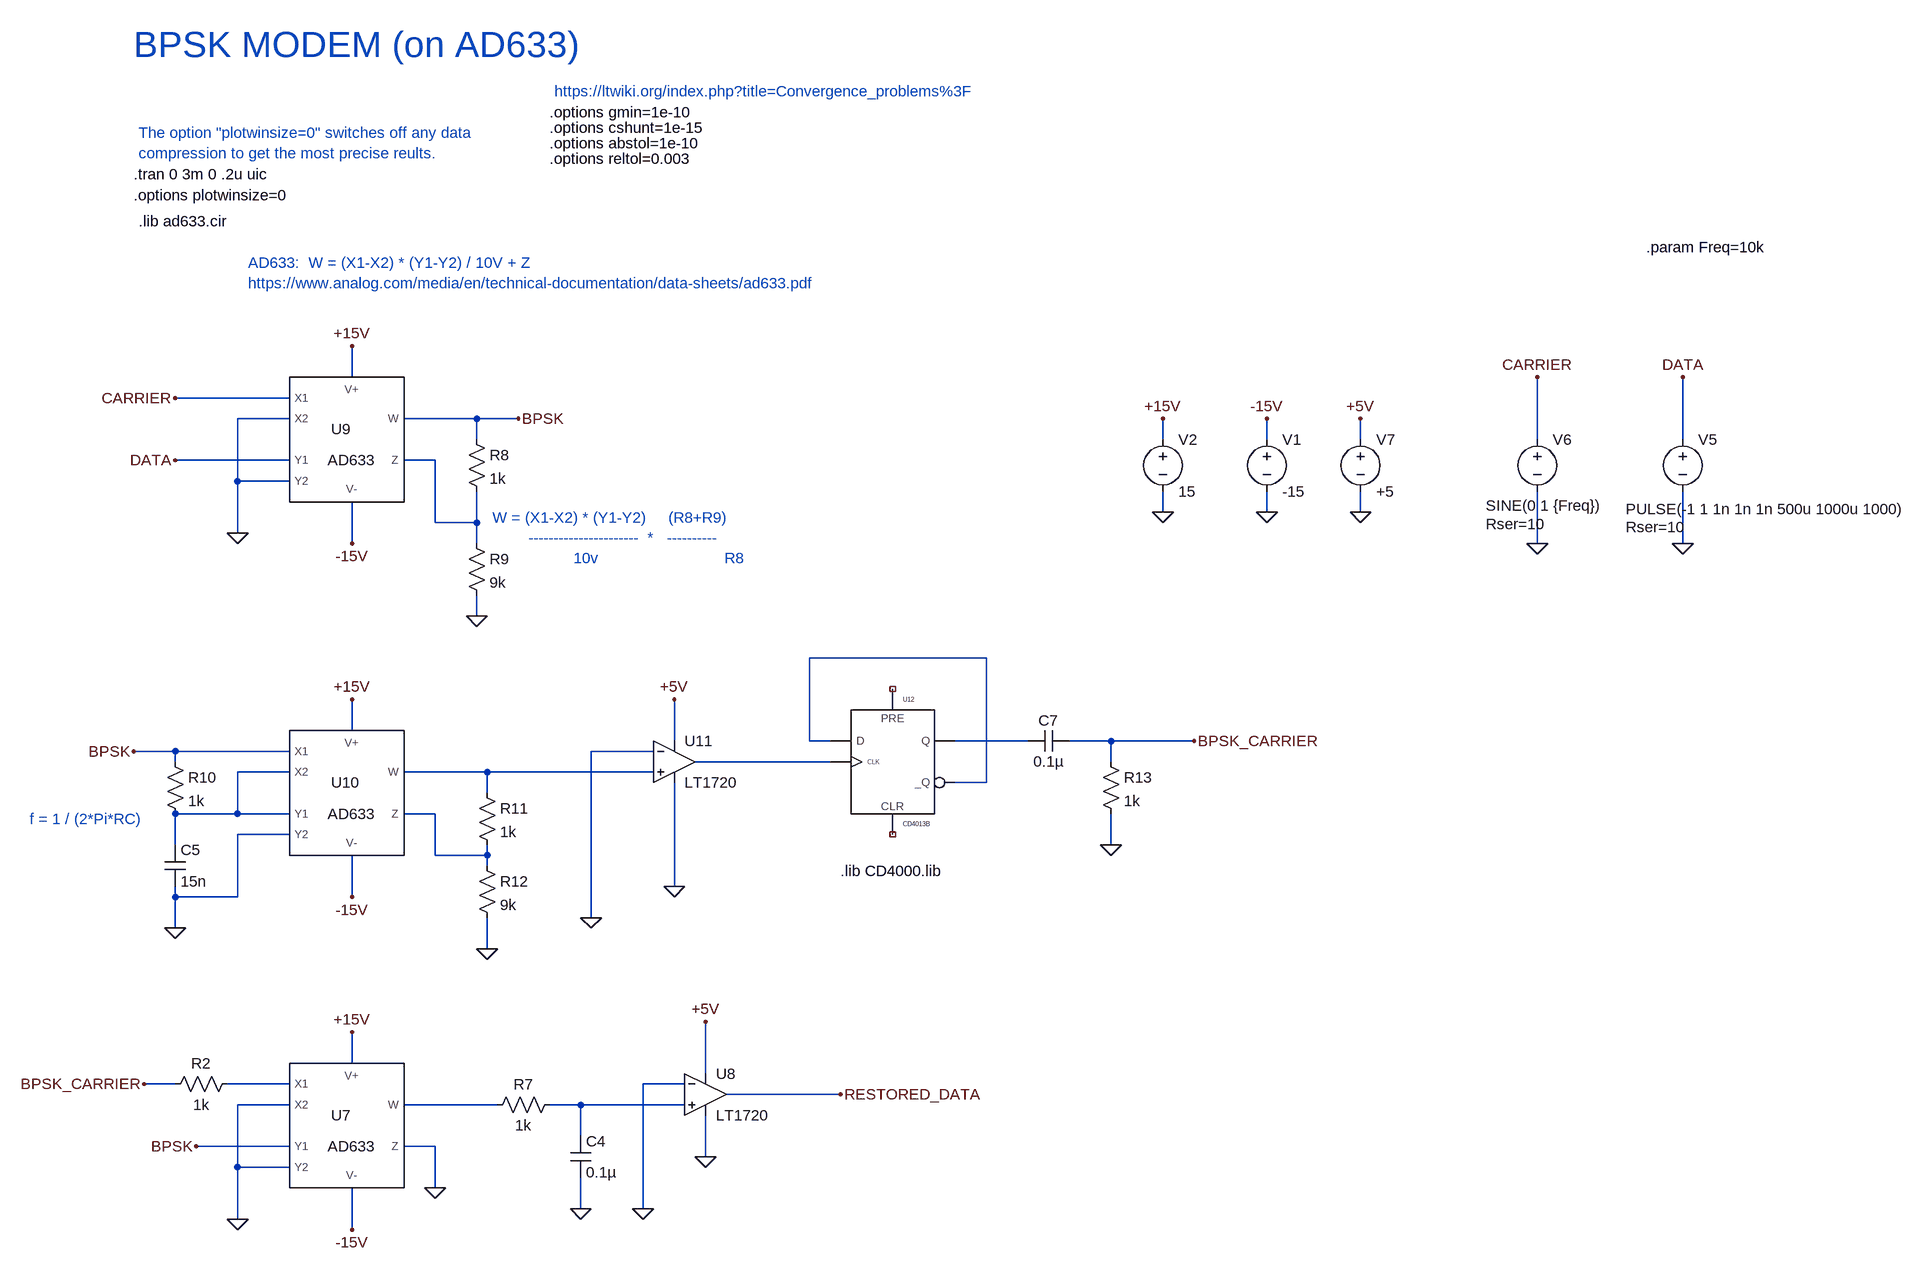
[diagram p0: schematic BPSK-modem-AD633.asc]
BPSK-modem-AD633.asc, the LTspice schematic file:
Version 4
SHEET 1 2516 2052
WIRE -800 416 -800 368
WIRE -896 448 -1072 448
WIRE -896 480 -976 480
WIRE -608 480 -720 480
WIRE -544 480 -608 480
WIRE -608 512 -608 480
WIRE 448 512 448 480
WIRE 608 512 608 480
WIRE 752 512 752 480
WIRE 1024 512 1024 416
WIRE 1248 512 1248 416
WIRE -896 544 -1072 544
WIRE -672 544 -720 544
WIRE -976 576 -976 480
WIRE -896 576 -976 576
WIRE 448 624 448 592
WIRE 608 624 608 592
WIRE 752 624 752 592
WIRE -672 640 -672 544
WIRE -608 640 -608 592
WIRE -608 640 -672 640
WIRE -976 656 -976 576
WIRE -800 672 -800 608
WIRE -608 672 -608 640
WIRE 1024 672 1024 592
WIRE 1248 672 1248 592
WIRE -608 784 -608 752
WIRE 176 848 -96 848
WIRE -800 960 -800 912
WIRE -304 976 -304 912
WIRE -96 976 -96 848
WIRE -64 976 -96 976
WIRE 240 976 128 976
WIRE 368 976 304 976
WIRE 496 976 368 976
WIRE -1072 992 -1136 992
WIRE -896 992 -1072 992
WIRE -336 992 -432 992
WIRE -1072 1008 -1072 992
WIRE -64 1008 -272 1008
WIRE 368 1008 368 976
WIRE -896 1024 -976 1024
WIRE -592 1024 -720 1024
WIRE -336 1024 -592 1024
WIRE 176 1040 176 848
WIRE 176 1040 128 1040
WIRE -592 1056 -592 1024
WIRE -976 1088 -976 1024
WIRE -976 1088 -1072 1088
WIRE -896 1088 -976 1088
WIRE -672 1088 -720 1088
WIRE -896 1120 -976 1120
WIRE -1072 1136 -1072 1088
WIRE 368 1136 368 1088
WIRE -672 1152 -672 1088
WIRE -592 1152 -592 1136
WIRE -592 1152 -672 1152
WIRE -592 1168 -592 1152
WIRE -304 1200 -304 1040
WIRE -1072 1216 -1072 1200
WIRE -976 1216 -976 1120
WIRE -976 1216 -1072 1216
WIRE -800 1216 -800 1152
WIRE -432 1248 -432 992
WIRE -1072 1264 -1072 1216
WIRE -592 1296 -592 1248
WIRE -800 1472 -800 1424
WIRE -256 1488 -256 1408
WIRE -1072 1504 -1120 1504
WIRE -896 1504 -992 1504
WIRE -288 1504 -352 1504
WIRE -48 1520 -224 1520
WIRE -896 1536 -976 1536
WIRE -576 1536 -720 1536
WIRE -448 1536 -496 1536
WIRE -288 1536 -448 1536
WIRE -448 1584 -448 1536
WIRE -896 1600 -1040 1600
WIRE -672 1600 -720 1600
WIRE -256 1616 -256 1552
WIRE -976 1632 -976 1536
WIRE -896 1632 -976 1632
WIRE -672 1664 -672 1600
WIRE -448 1696 -448 1648
WIRE -352 1696 -352 1504
WIRE -976 1712 -976 1632
WIRE -800 1728 -800 1664
FLAG 608 480 -15V
FLAG 448 480 +15V
FLAG 448 624 0
FLAG 608 624 0
FLAG 1248 672 0
FLAG 1024 672 0
FLAG 1024 416 CARRIER
FLAG 1248 416 DATA
FLAG 752 624 0
FLAG 752 480 +5V
FLAG -672 1664 0
FLAG -976 1712 0
FLAG -1120 1504 BPSK_CARRIER
FLAG -1040 1600 BPSK
FLAG -800 1728 -15V
FLAG -800 1424 +15V
FLAG -448 1696 0
FLAG -352 1696 0
FLAG -256 1616 0
FLAG -256 1408 +5V
FLAG -48 1520 RESTORED_DATA
FLAG -800 368 +15V
FLAG -800 672 -15V
FLAG -976 656 0
FLAG -1072 544 DATA
FLAG -1072 448 CARRIER
FLAG -608 784 0
FLAG -544 480 BPSK
FLAG -800 912 +15V
FLAG -800 1216 -15V
FLAG -1136 992 BPSK
FLAG -1072 1264 0
FLAG -592 1296 0
FLAG -432 1248 0
FLAG -304 1200 0
FLAG -304 912 +5V
FLAG 368 1136 0
FLAG 496 976 BPSK_CARRIER
SYMBOL voltage 608 496 R0
WINDOW 123 0 0 Left 0
WINDOW 39 0 0 Left 0
SYMATTR InstName V1
SYMATTR Value -15
SYMBOL voltage 448 496 R0
WINDOW 123 0 0 Left 0
WINDOW 39 0 0 Left 0
SYMATTR InstName V2
SYMATTR Value 15
SYMBOL voltage 1248 496 R0
WINDOW 3 -88 123 Left 2
WINDOW 123 0 0 Left 0
WINDOW 39 -88 151 Left 2
SYMATTR Value PULSE(-1 1 1n 1n 1n 500u 1000u 1000)
SYMATTR SpiceLine Rser=10
SYMATTR InstName V5
SYMBOL voltage 1024 496 R0
WINDOW 3 -79 118 Left 2
WINDOW 123 0 0 Left 0
WINDOW 39 -79 146 Left 2
SYMATTR Value SINE(0 1 {Freq})
SYMATTR SpiceLine Rser=10
SYMATTR InstName V6
SYMBOL voltage 752 496 R0
WINDOW 123 0 0 Left 0
WINDOW 39 0 0 Left 0
SYMATTR InstName V7
SYMATTR Value +5
SYMBOL ad633 -800 1568 R0
SYMATTR InstName U7
SYMBOL res -976 1488 R90
WINDOW 0 0 56 VBottom 2
WINDOW 3 32 56 VTop 2
SYMATTR InstName R2
SYMATTR Value 1k
SYMBOL res -480 1520 R90
WINDOW 0 0 56 VBottom 2
WINDOW 3 32 56 VTop 2
SYMATTR InstName R7
SYMATTR Value 1k
SYMBOL cap -464 1584 R0
SYMATTR InstName C4
SYMATTR Value 0.1µ
SYMBOL Comparators\\LT1720 -256 1456 R0
SYMATTR InstName U8
SYMBOL ad633 -800 512 R0
SYMATTR InstName U9
SYMBOL res -624 496 R0
SYMATTR InstName R8
SYMATTR Value 1k
SYMBOL res -624 656 R0
SYMATTR InstName R9
SYMATTR Value 9k
SYMBOL ad633 -800 1056 R0
SYMATTR InstName U10
SYMBOL res -1088 992 R0
SYMATTR InstName R10
SYMATTR Value 1k
SYMBOL cap -1088 1136 R0
SYMATTR InstName C5
SYMATTR Value 15n
SYMBOL res -608 1040 R0
SYMATTR InstName R11
SYMATTR Value 1k
SYMBOL res -608 1152 R0
SYMATTR InstName R12
SYMATTR Value 9k
SYMBOL Comparators\\LT1720 -304 944 R0
SYMATTR InstName U11
SYMBOL CD4000\\CD4013B 32 896 R0
SYMATTR InstName U12
SYMBOL cap 304 960 R90
WINDOW 0 0 32 VBottom 2
WINDOW 3 32 32 VTop 2
SYMATTR InstName C7
SYMATTR Value 0.1µ
SYMBOL res 352 992 R0
SYMATTR InstName R13
SYMATTR Value 1k
TEXT -1128 40 Left 2 ;The option "plotwinsize=0" switches off any data \ncompression to get the most precise reults.
TEXT -1136 136 Left 2 !.options plotwinsize=0
TEXT -960 240 Left 2 ;AD633:  W = (X1-X2) * (Y1-Y2) / 10V + Z\nhttps://www.analog.com/media/en/technical-documentation/data-sheets/ad633.pdf
TEXT -1136 104 Left 2 !.tran 0 3m 0 .2u uic
TEXT -1128 176 Left 2 !.lib ad633.cir
TEXT -1136 -96 Left 5 ;BPSK MODEM (on AD633)
TEXT -496 56 Left 2 !.options abstol=1e-10
TEXT -496 8 Left 2 !.options gmin=1e-10
TEXT -496 80 Left 2 !.options reltol=0.003
TEXT -496 32 Left 2 !.options cshunt=1e-15
TEXT -488 -24 Left 2 ;https://ltwiki.org/index.php?title=Convergence_problems%3F
TEXT -584 632 Left 2 ;W = (X1-X2) * (Y1-Y2)     (R8+R9)\n        ----------------------  *   ----------\n                  10v                            R8
TEXT -48 1176 Left 2 !.lib CD4000.lib
TEXT -1296 1096 Left 2 ;f = 1 / (2*Pi*RC)
TEXT 1192 216 Left 2 !.param Freq=10k

The netlist it stands for:
* BPSK-modem-AD633.asc
V1 -15V 0 -15
V2 +15V 0 15
V5 DATA 0 PULSE(-1 1 1n 1n 1n 500u 1000u 1000) Rser=10
V6 CARRIER 0 SINE(0 1 {Freq}) Rser=10
V7 +5V 0 +5
XU7 N008 0 BPSK 0 -15V 0 N009 +15V AD633  ; pins X1 X2 Y1 Y2 V- Z W V+
R2 N008 BPSK_CARRIER 1k
R7 N010 N009 1k
C4 N010 0 0.1µ
XU8 N010 0 +5V 0 RESTORED_DATA LT1720  ; pins In+ In- V+ V- OUT
XU9 CARRIER 0 DATA 0 -15V N001 BPSK +15V AD633  ; pins X1 X2 Y1 Y2 V- Z W V+
R8 BPSK N001 1k
R9 N001 0 9k
XU10 BPSK N005 N005 0 -15V N007 N006 +15V AD633  ; pins X1 X2 Y1 Y2 V- Z W V+
R10 BPSK N005 1k
C5 N005 0 15n
R11 N006 N007 1k
R12 N007 0 9k
XU11 N006 0 +5V 0 N004 LT1720  ; pins In+ In- V+ V- OUT
XU12 NC_01 N004 N002 NC_02 N003 N002 VDD 0 CD4013B VDD=5  SPEED=1.0  TRIPDT=5e-9  ; pins PRE CP D CLR Q _Q
C7 BPSK_CARRIER N003 0.1µ
R13 BPSK_CARRIER 0 1k
* The option "plotwinsize=0" switches off any data
* compression to get the most precise reults.
.options plotwinsize=0
* AD633:  W = (X1-X2) * (Y1-Y2) / 10V + Z
* https://www.analog.com/media/en/technical-documentation/data-sheets/ad633.pdf
.tran 0 3m 0 .2u uic
.lib ad633.cir
* BPSK MODEM (on AD633)
.options abstol=1e-10
.options gmin=1e-10
.options reltol=0.003
.options cshunt=1e-15
* https://ltwiki.org/index.php?title=Convergence_problems%3F
* W = (X1-X2) * (Y1-Y2)     (R8+R9)
*         ----------------------  *   ----------
*                   10v                            R8
.lib CD4000.lib
* f = 1 / (2*Pi*RC)
.param Freq=10k
.lib LT1720.sub
.backanno
.end